# EAGLE design esp_pilote clean (EAGLE 8.0.0)

## Sheet 1 of 2
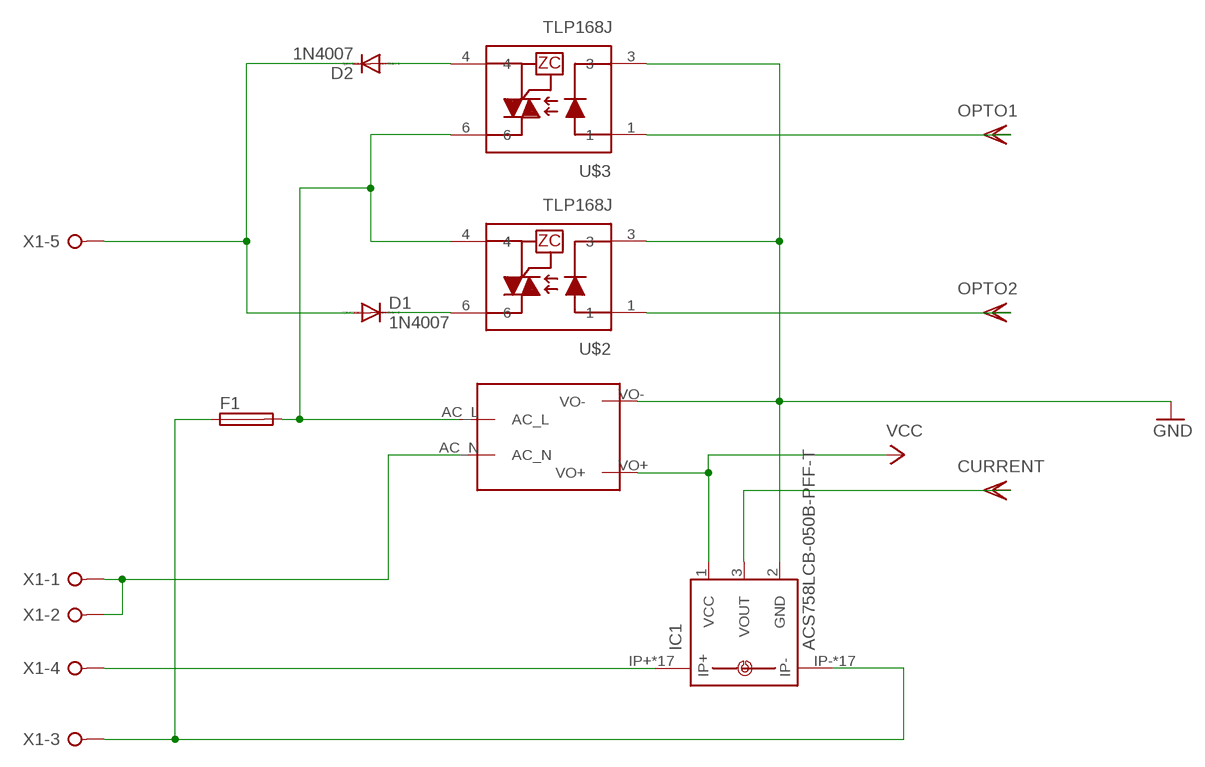
[diagram p0: schematic, sheet 1]

### Parts
D1  1N4007  1N4004  [DO41-10]
D2  1N4007  1N4004  [DO41-10]
F1  19560  [19560]
IC1  ACS758LCB-050B-PFF-T  [CB-PFF]
U$1  MAINS_CONVERTERS  [HLK-PM01]
U$2  TLP168J  [MFSOP-4]
U$3  TLP168J  [MFSOP-4]
X1  W237-05P  [W237-5P]

### Nets
230FUSED: F1.2 U$1.AC_L U$2.4 U$3.6
230OUT: F1.1 IC1.IP- IC1.IP-@2(IP-) IC1.IP-@3(IP-) IC1.IP-@4(IP-) IC1.IP-@5(IP-) IC1.IP-@6(IP-) IC1.IP-@7(IP-) IC1.IP-@8(IP-) IC1.IP-@9(IP-) IC1.IP-@10(IP-) IC1.IP-@11(IP-) IC1.IP-@12(IP-) IC1.IP-@13(IP-) IC1.IP-@14(IP-) IC1.IP-@15(IP-) IC1.IP-@16(IP-) IC1.IP-@17(IP-) X1.3
CURENT: IC1.3(VOUT) ; supply symbol labelled CURRENT ; also sheet 2
GND: IC1.2(GND) U$1.VO- U$2.3 U$3.3 ; also sheet 2
N$6: IC1.IP+ IC1.IP+@2(IP+) IC1.IP+@3(IP+) IC1.IP+@4(IP+) IC1.IP+@5(IP+) IC1.IP+@6(IP+) IC1.IP+@7(IP+) IC1.IP+@8(IP+) IC1.IP+@9(IP+) IC1.IP+@10(IP+) IC1.IP+@11(IP+) IC1.IP+@12(IP+) IC1.IP+@13(IP+) IC1.IP+@14(IP+) IC1.IP+@15(IP+) IC1.IP+@16(IP+) IC1.IP+@17(IP+) X1.4
NEUTRAL: U$1.AC_N X1.1 X1.2
OPTO1: U$3.1 ; also sheet 2
OPTO2: U$2.1 ; also sheet 2
OPTO_O1: D2.A U$3.4
OPTO_O2: D1.C U$2.6
PILOTE: D1.A D2.C X1.5
VCC: IC1.1(VCC) U$1.VO+ ; also sheet 2

## Sheet 2 of 2
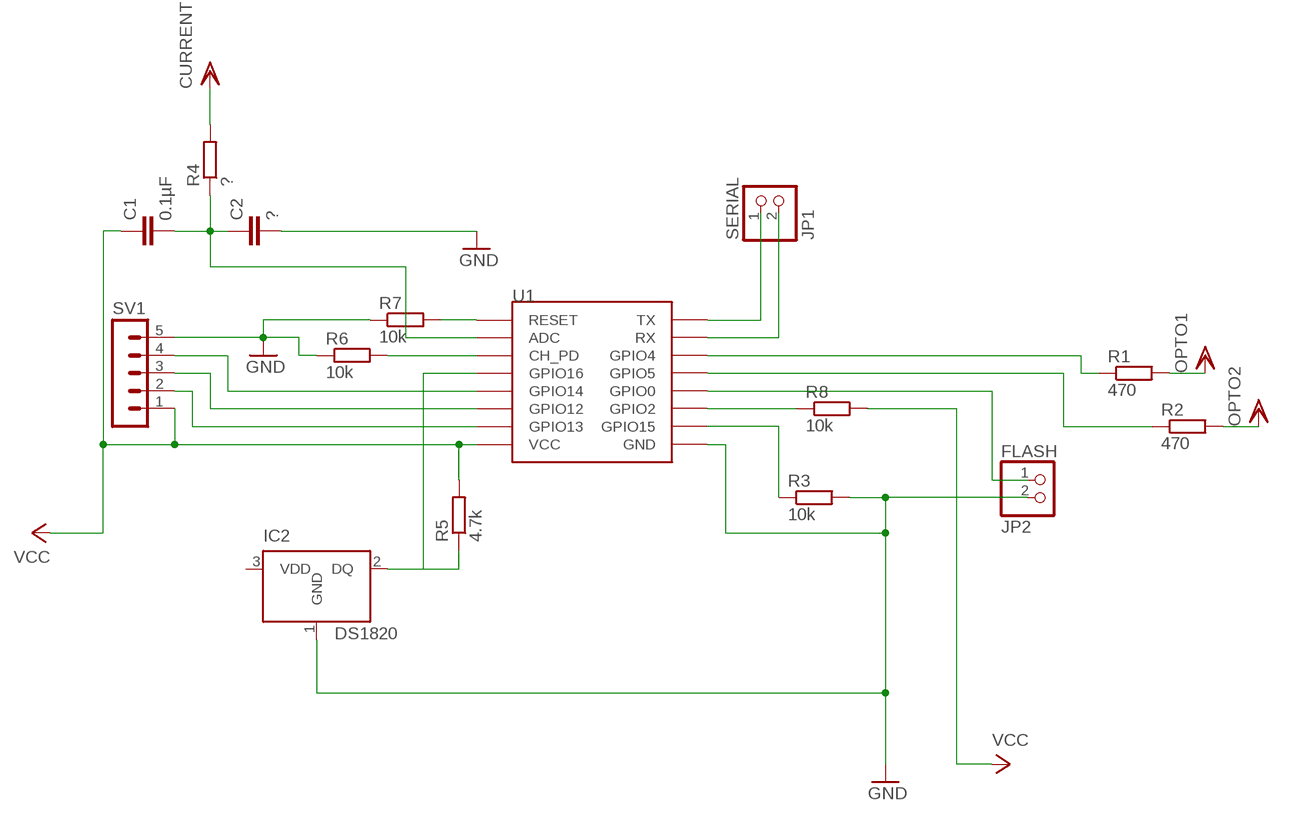
[diagram p1: schematic, sheet 2]

### Parts
C1  0.1µF  C5/3.5  [C5B3.5]
C2  ?  C5/3.5  [C5B3.5]
FLASH  JP2  PINHD-1X2  [1X02]
IC2  DS1820  [TO-92]
R1  470  R-EU_0207/10  [0207/10]
R2  470  R-EU_0207/10  [0207/10]
R3  10k  R-EU_0207/10  [0207/10]
R4  ?  R-EU_0207/10  [0207/10]
R5  4.7k  R-EU_0207/10  [0207/10]
R6  10k  R-EU_0207/10  [0207/10]
R7  10k  R-EU_0207/10  [0207/10]
R8  10k  R-EU_0207/10  [0207/10]
SERIAL  JP1  PINHD-1X2  [1X02]
SV1  MA05-1  [MA05-1]
U1  ESP12SMD  [ESP12-SMD]

### Nets
CH_PD: R6.2 U1.CH_PD
CURENT: R4.2 ; supply symbol labelled CURRENT ; also sheet 1
CURRENT: C1.2 C2.1 R4.1 U1.ADC
DS18B20: IC2.2(DQ) R5.1 U1.GPIO16
GND: C2.2 FLASH.2 IC2.1(GND) R3.2 R6.1 R7.1 SV1.5 U1.GND ; also sheet 1
GP12: SV1.3 U1.GPIO12
GP13: SV1.2 U1.GPIO13
GP14: SV1.4 U1.GPIO14
N$1: SERIAL.1 U1.TXD0(TX)
N$2: SERIAL.2 U1.RXD0(RX)
N$3: FLASH.1 U1.GPIO0
N$4: R3.1 U1.GPIO15
N$5: R8.1 U1.GPIO2
OPTO1: R1.2 ; also sheet 1
OPTO1_OUT: R1.1 U1.GPIO4
OPTO2: R2.2 ; also sheet 1
OPTO2_OUT: R2.1 U1.GPIO5
RST: R7.2 U1.RESET
VCC: C1.1 R5.2 R8.2 SV1.1 U1.VCC ; also sheet 1
Unconnected: IC2.3(VDD)

## Library data of the parts
C1 C2 = capacitor-wima:C: CAPACITOR naming: grid - package width
D1 D2 = diode:1N4004: DIODE general purpose rectifier, 1 A
F1 = fuse:19560: FUSE HOLDER TR5, Wickmann; MPN: 56000001009; OC_FARNELL: 1185363; OC_NEWARK: 15P8392
FLASH SERIAL = pinhead:PINHD-1X2: PIN HEADER
IC1 = allegro-2:ACS758*: Thermally Enhanced, Fully Integrated, Hall Effect-Based Linear Current Sensor with 100 micro Ohm Current Conductor display layer 49 Reference in BRD and place VIAs on circles Source: http://www.allegromicro.com/en/Products/Part_Numbers/0758/0758.pdf; MPN: ACS758LCB-050B-PFF-T; OC_FARNELL: 1718997; OC_NEWARK: 04R7131
IC2 = DS1820:DS1820: DS1820 - 1-Wire Digital Thermometer
R1-R8 = resistor:R-EU_: RESISTOR, European symbol
SV1 = con-lstb:MA05-1: PIN HEADER; OC_FARNELL: unknown; OC_NEWARK: unknown
U1 = esp8266modules:ESP12: ESP8266 Wifi module 12
U$1 = captain-slow:MAINS_CONVERTERS
U$2 U$3 = TLP168J:TLP168J
X1 = con-wago-508:W237-05P: WAGO SREW CLAMP; OC_FARNELL: unknown; OC_NEWARK: unknown

## Net classes
0 default: width 1 mm

## Board
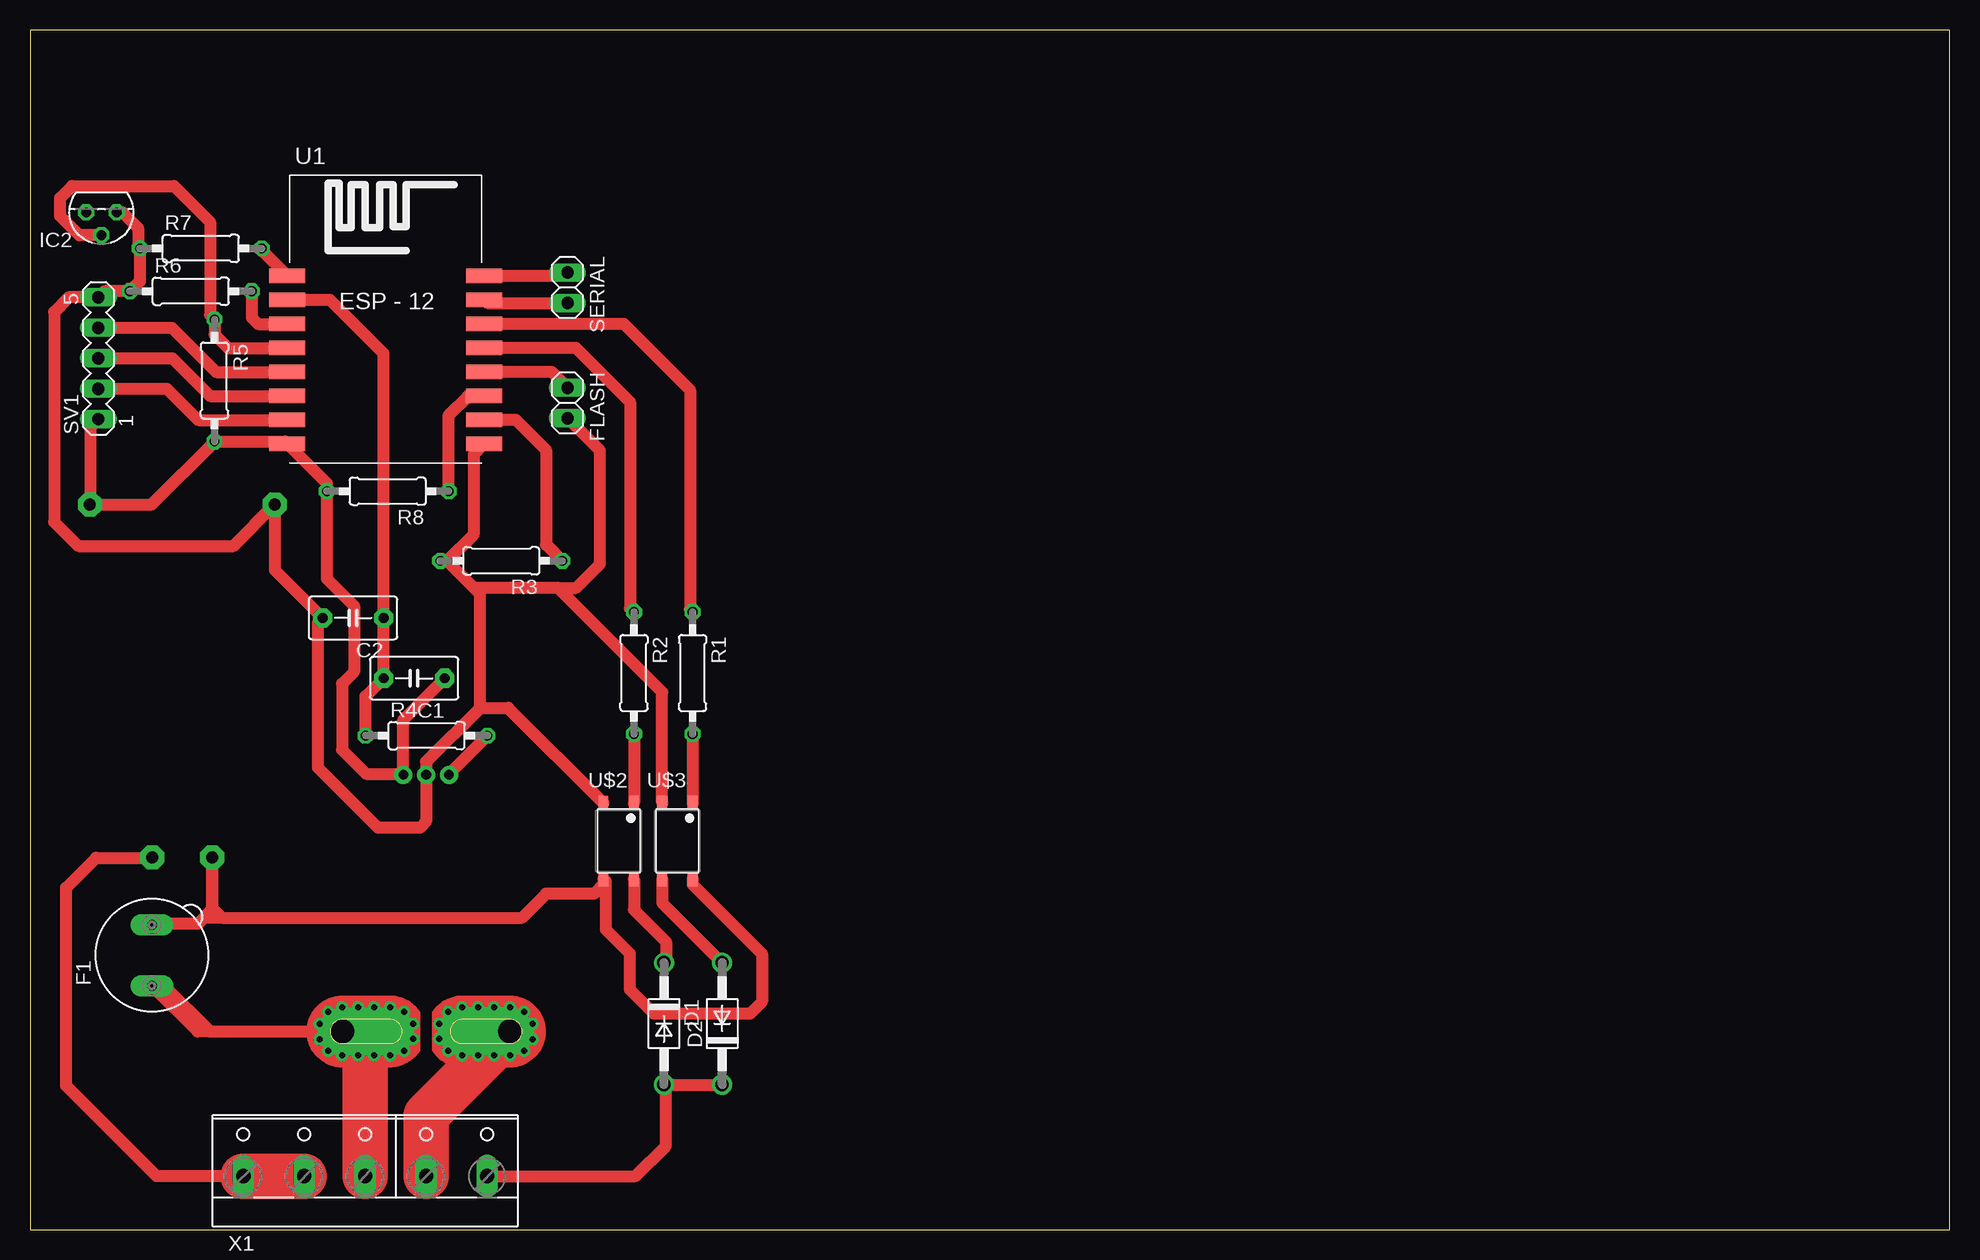
[diagram p2: board, top side]
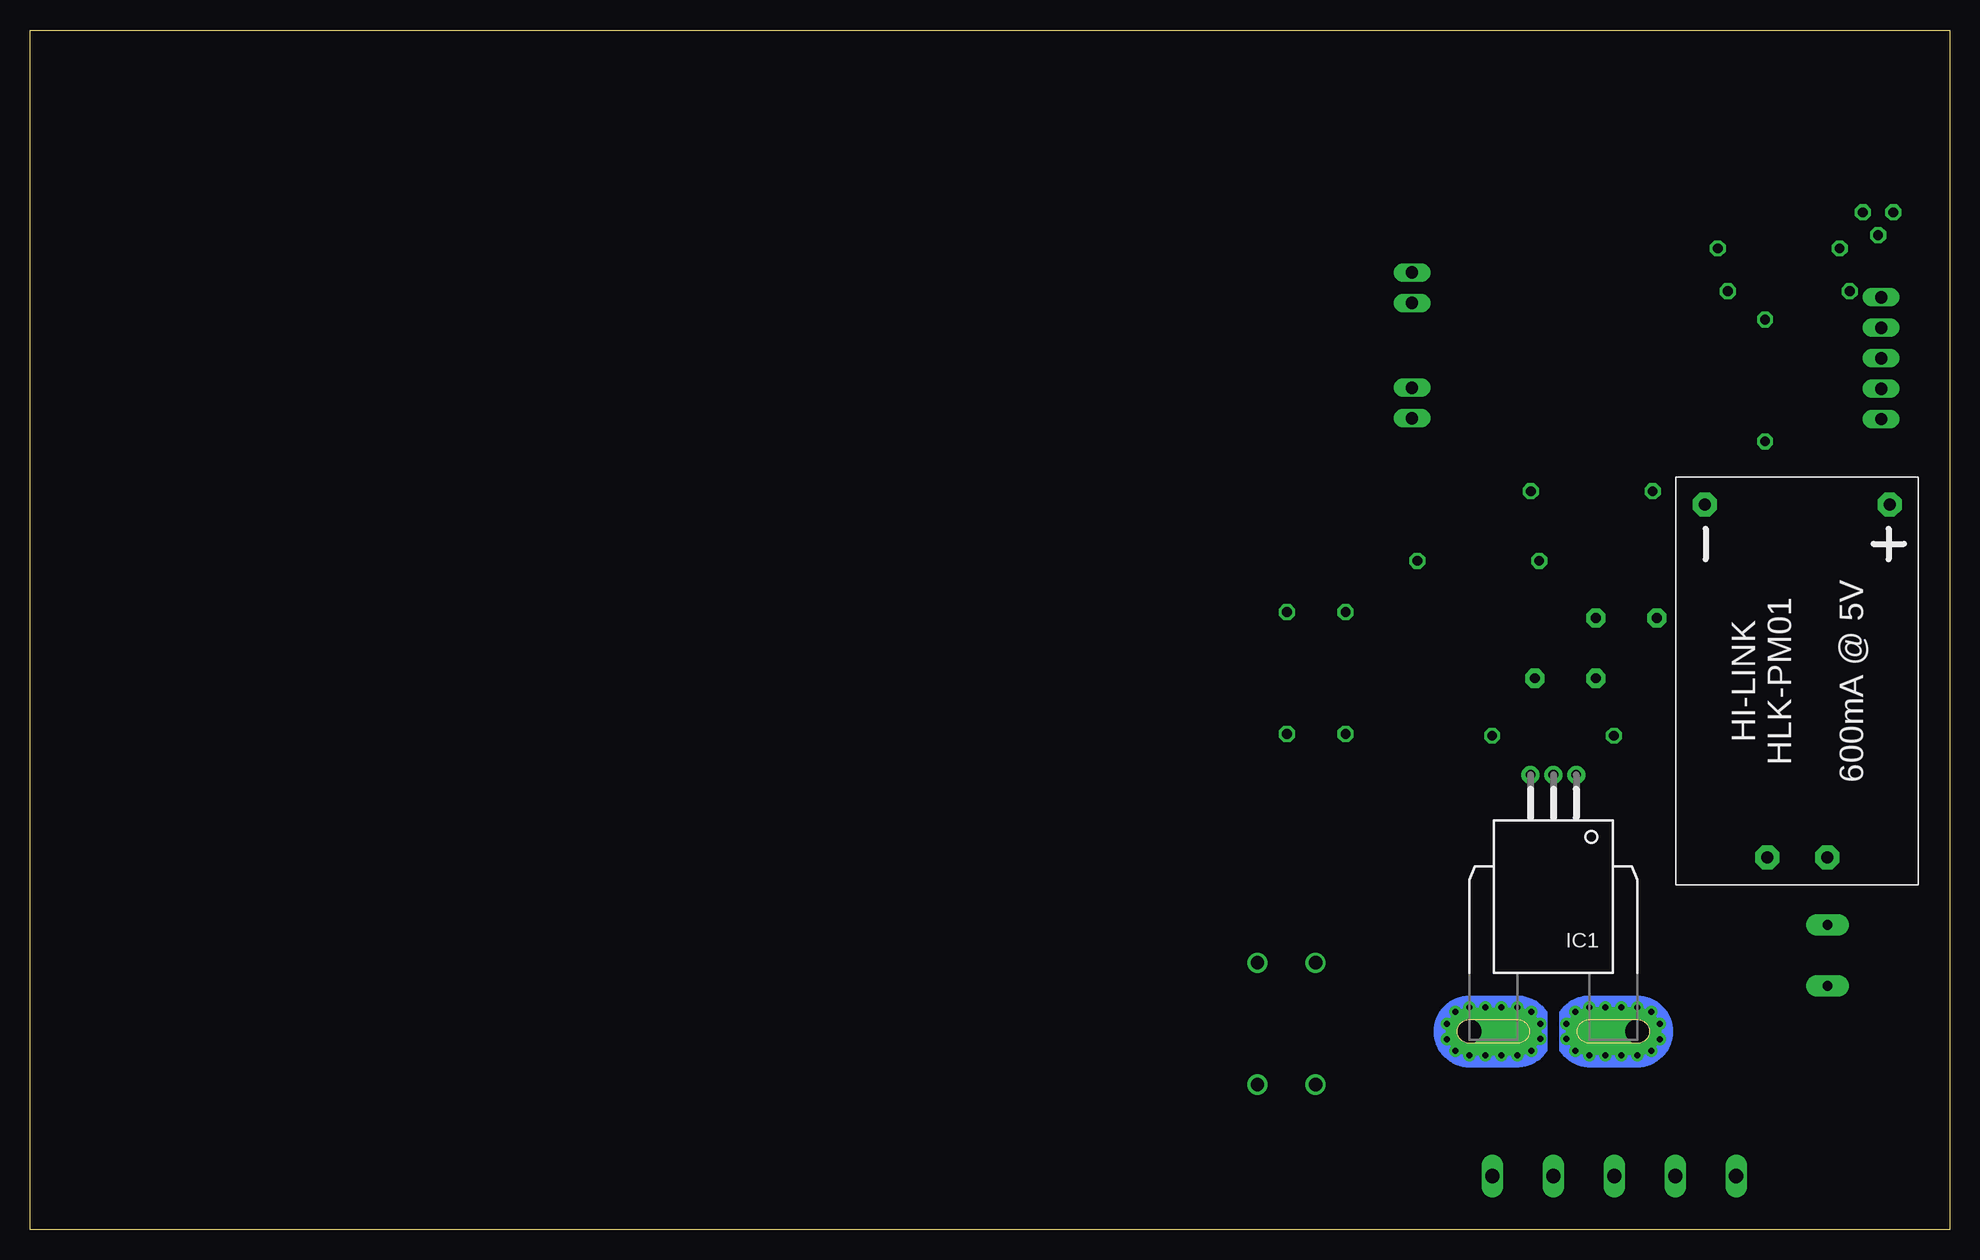
[diagram p3: board, bottom side, seen from below]

Size 160 x 100 mm. Coordinates in mm from the lower left corner, seen from the top.
Outline: 0,0 160,0 160,100 0,100 0,0
Copper layers (1*16): Top 0.035mm / dielectric 1.5mm / Bottom 0.035mm
Design rules "default": minimum track width 10mil, minimum drill 24mil, track to track 8mil, track to pad 8mil, pad to pad 8mil, via to via 8mil, smd to smd 8mil, copper to edge 40mil, drill to drill 8mil, minimum pad ring 10mil, minimum via ring 8mil, stop-mask expansion 4mil, vias tented up to drill 0mil, thermal gap 10mil

### Footprints (pad centres in the part's own frame; a part is rotated, then mirrored left to right if it is on the bottom)
C5B3.5 = drill 0.813 pad 1.6 octagon: 1 -2.54,0; 2 2.54,0
DO41-10 = drill 1.118: A 5.08,0; C -5.08,0
19560 = drill 0.813 pad 1.778 long: 1 -2.54,0; 2 2.54,0
1X02 = drill 1.016 long: 1 -1.27,0; 2 1.27,0
CB-PFF = drill 0.8 pad 1.5: 1 -1.91,-21.4; 2 0,-21.4; 3 1.91,-21.4 | drill 2 pad 4 offset: IP+ 7,0; IP- -7,0 | drill 0.5 pad 0.9: IP+@2 8.89,0.635; IP+@3 8.89,-0.635; IP+@4 8.175,-1.625; IP+@5 7,-2; IP+@6 5.675,-2; IP+@7 4.35,-2; IP+@8 3,-2; IP+@9 1.825,-1.625; IP+@10 1.1,-0.625; IP+@11 1.1,0.625; IP+@12 1.825,1.625; IP+@13 3,2; IP+@14 4.35,2; IP+@15 5.675,2; IP+@16 7,2; IP+@17 8.175,1.625; IP-@2 -8.89,0.635; IP-@3 -8.89,-0.635; IP-@4 -8.175,-1.625; IP-@5 -7,-2; IP-@6 -5.675,-2; IP-@7 -4.325,-2; IP-@8 -3,-2; IP-@9 -1.825,-1.625; IP-@10 -1.1,-0.625; IP-@11 -1.1,0.625; IP-@12 -1.825,1.625; IP-@13 -3,2; IP-@14 -4.325,2; IP-@15 -5.675,2; IP-@16 -7,2; IP-@17 -8.175,1.625
TO-92 = drill 0.813 pad 1.27 octagon: 1 -1.27,0; 2 0,1.905; 3 1.27,0
0207/10 = drill 0.813 octagon: 1 -5.08,0; 2 5.08,0
MA05-1 = drill 1.016 long: 1 -5.08,0; 2 -2.54,0; 3 0,0; 4 2.54,0; 5 5.08,0
ESP12-SMD = smd 3 x 1.2: ADC -8.3,3.8; CH_PD -8.3,1.8; GND 8.1,-8.2; GPIO0 8.1,-2.2; GPIO2 8.1,-4.2; GPIO4 8.1,1.8; GPIO5 8.1,-0.2; GPIO12 -8.3,-4.2; GPIO13 -8.3,-6.2; GPIO14 -8.3,-2.2; GPIO15 8.1,-6.2; GPIO16 -8.3,-0.2; RESET -8.3,5.8; RXD0 8.1,3.8; TXD0 8.1,5.8; VCC -8.3,-8.2
HLK-PM01 = drill 1 pad 2 octagon: AC_L -14.7,2.5; AC_N -14.7,-2.5; VO+ 14.7,-7.7; VO- 14.7,7.7
MFSOP-4 = smd 0.8 x 1.2: 1 2.54,0; 3 0,0; 4 0,-6.35; 6 2.54,-6.35
W237-5P = drill 1.194 long: 1 -10.16,-0.635; 2 -5.08,-0.635; 3 0,-0.635; 4 5.08,-0.635; 5 10.16,-0.635

### Placement (x,y rotation side)
C1  32.02,45.95 180 top
C2  26.93,50.98 180 top
D1  52.84,17.16 270 top
D2  57.69,17.16 90 top
F1  10.16,22.86 90 top
FLASH  44.8,68.9 270 top
IC1  33.02,16.51 180 bottom
IC2  5.95,84.8 180 top
R1  55.23,46.39 270 top
R2  50.34,46.39 270 top
R3  39.28,55.74 180 top
R4  33.05,41.17 0 top
R5  15.38,70.78 270 top
R6  13.4,78.22 0 top
R7  14.24,81.79 0 top
R8  29.82,61.55 180 top
SERIAL  44.8,78.52 270 top
SV1  5.7,72.63 90 top
U1  29.75,73.71 0 top
U$1  12.7,45.72 90 bottom
U$2  47.8,35.56 0 top
U$3  52.69,35.56 0 top
X1  27.94,5.08 0 top

### Tracks (layer width: path | path; a pad name or v marks a point on that pad's centre or on a via)
230FUSED
  Top 1: 14,25.5 15.2,26.7 U$1.AC_L 15.2,26.8 16,26 | 14,25.5 10.26,25.5 F1.2 | U$3.6 55.23,28.77 61,23 61,19 60,18 52,18 50,20 50,23 48,25 48,29.01 U$2.4 47.8,28.8 47,28 43,28 41,26 16,26 | 16,26 14.5,26 14,25.5
230OUT
  Top 1: 15,16.51 IC1.IP- | 15,16.51 13.97,16.51 F1.1 11.19,20.32 15,16.51
  Top 3.81: X1.3 27.94,14.59 IC1.IP-
CH_PD
  Top 1: R6.2 18.48,76.02 19,75.5 U1.CH_PD
CURENT
  Top 1: IC1.3 34.93,37.97 R4.2
CURRENT
  Top 1: R4.1 27.97,44.44 C1.2 C2.1 29.47,73.03 25,77.5 U1.ADC
DS18B20
  Top 1: IC2.2 4.11,82.89 2.5,84.5 2.5,86 3.5,87 12,87 15,84 15,76.24 R5.1 15.38,74.62 16.5,73.5 U1.GPIO16
GND
  Top 1: U1.GND 37,64.66 37,58 34.74,55.74 R3.2 34.76,55.74 37,53.5 | 6.08,77.71 SV1.5 | IC2.1 7.7,84.8 9,83.5 9,81.95 R7.1 9.16,79.06 R6.1 6.21,78.22 SV1.5 | SV1.5 3.21,77.71 2,76.5 2,59 4,57 16.98,57 U$1.VO- 20.4,54.97 C2.2 24,50.59 24,38.5 29,33.5 32.5,33.5 33.02,34.02 IC1.2 33.02,39.02 37.5,43.5 | 44,53.5 37,53.5 | 44,53.5 45.5,53.5 47.5,55.5 47.5,64.93 FLASH.2 | 37.5,43.5 37.5,53 37,53.5 | 37.5,43.5 39.86,43.5 U$2.3 | U$3.3 52.69,44.81 44,53.5
GP12
  Top 1: SV1.3 11.87,72.63 15,69.5 U1.GPIO12
GP13
  Top 1: SV1.2 11.41,70.09 14,67.5 U1.GPIO13
GP14
  Top 1: SV1.4 11.83,75.17 15.5,71.5 U1.GPIO14
N$1
  Top 1: U1.TXD0 44.8,79.51 SERIAL.1
N$2
  Top 1: U1.RXD0 38.11,77.25 SERIAL.2
N$3
  Top 1: U1.GPIO0 43.46,71.51 FLASH.1
N$4
  Top 1: U1.GPIO15 40.49,67.51 43,65 43,57.1 R3.1
N$5
  Top 1: R8.1 34.9,67.9 36.5,69.5 U1.GPIO2
N$6
  Top 3.81: X1.4 33.02,9.51 IC1.IP+
NEUTRAL
  Top 1: X1.2 X1.1 10.55,4.45 3,12 3,28.5 5.5,31 10.18,31 U$1.AC_N
  Top 3.81: X1.2 X1.1
OPTO1
  Top 1: R1.2 U$3.1
OPTO1_OUT
  Top 1: U1.GPIO4 49.49,75.51 55,70 55,51.7 R1.1
OPTO2
  Top 1: R2.2 U$2.1
OPTO2_OUT
  Top 1: U1.GPIO5 45.49,73.51 50,69 50,51.81 R2.1
OPTO_O1
  Top 1: U$3.4 52.69,27.24 D2.A
OPTO_O2
  Top 1: U$2.6 50.34,26.66 53,24 53,22.4 D1.C
PILOTE
  Top 1: X1.5 50.45,4.45 53,7 53,11.92 D1.A D2.C
RST
  Top 1: R7.2 19.32,81.64 U1.RESET
VCC
  Top 1: SV1.1 5,66.85 U$1.VO+ 10.1,60.42 R5.2 21.26,65.7 U1.VCC 24.74,62.22 R8.2 24.74,54.26 27,52 27,46.5 26,45.5 26,40 28,38 31.02,38 IC1.1 31.11,42.5 C1.1